# Altium schematic sheet bela_expansion_card_1.SchDoc
size 241 x 175 mm
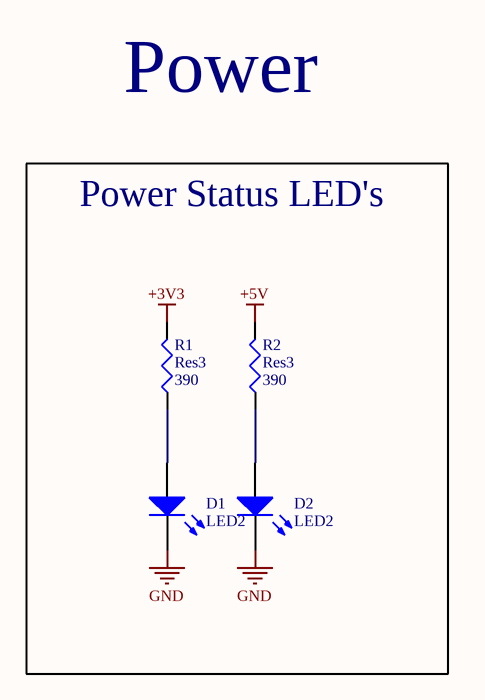
[diagram p0: bela_expansion_card_1.SchDoc]

## Parts
D1  LED2  [3.2X1.6X1.1]
D2  LED2  [3.2X1.6X1.1]
R1  Res3  value 390  [6-0805_L]
R2  Res3  value 390  [6-0805_L]

## Blocks framed on the sheet
Power Status LED's: D1 D2 R1 R2

## Nets
+3V3: R1.2
+5V: R2.2
GND: D1.2(K) D2.2(K)
NetD1_1: D1.1(A) R1.1
NetD2_1: D2.1(A) R2.1

## Notes on the sheet
- Power

## Library data of the parts
D1 D2 = LED2: Typical RED, GREEN, YELLOW, AMBER GaAs LED; Published: 8-Jun-2000; LatestRevisionDate: 17-Jul-2002; LatestRevisionNote: Re-released for DXP Platform.; PackageVersion: Feb-2002; PackageReference: 3.2X1.6X1.1; Publisher: Altium Limited; PackageDescription: SM LED; 2 Flat Leads
R1 R2 = Res3: Resistor; Published: 8-Jun-2000; LatestRevisionDate: 29-May-2009; LatestRevisionNote: IPC-7351 Footprint Added.; PackageReference: J1-0603; Publisher: Altium Limited; PackageDescription: Chip Resistor